# EAGLE design display_device_rev2 (EAGLE 8.3.2)
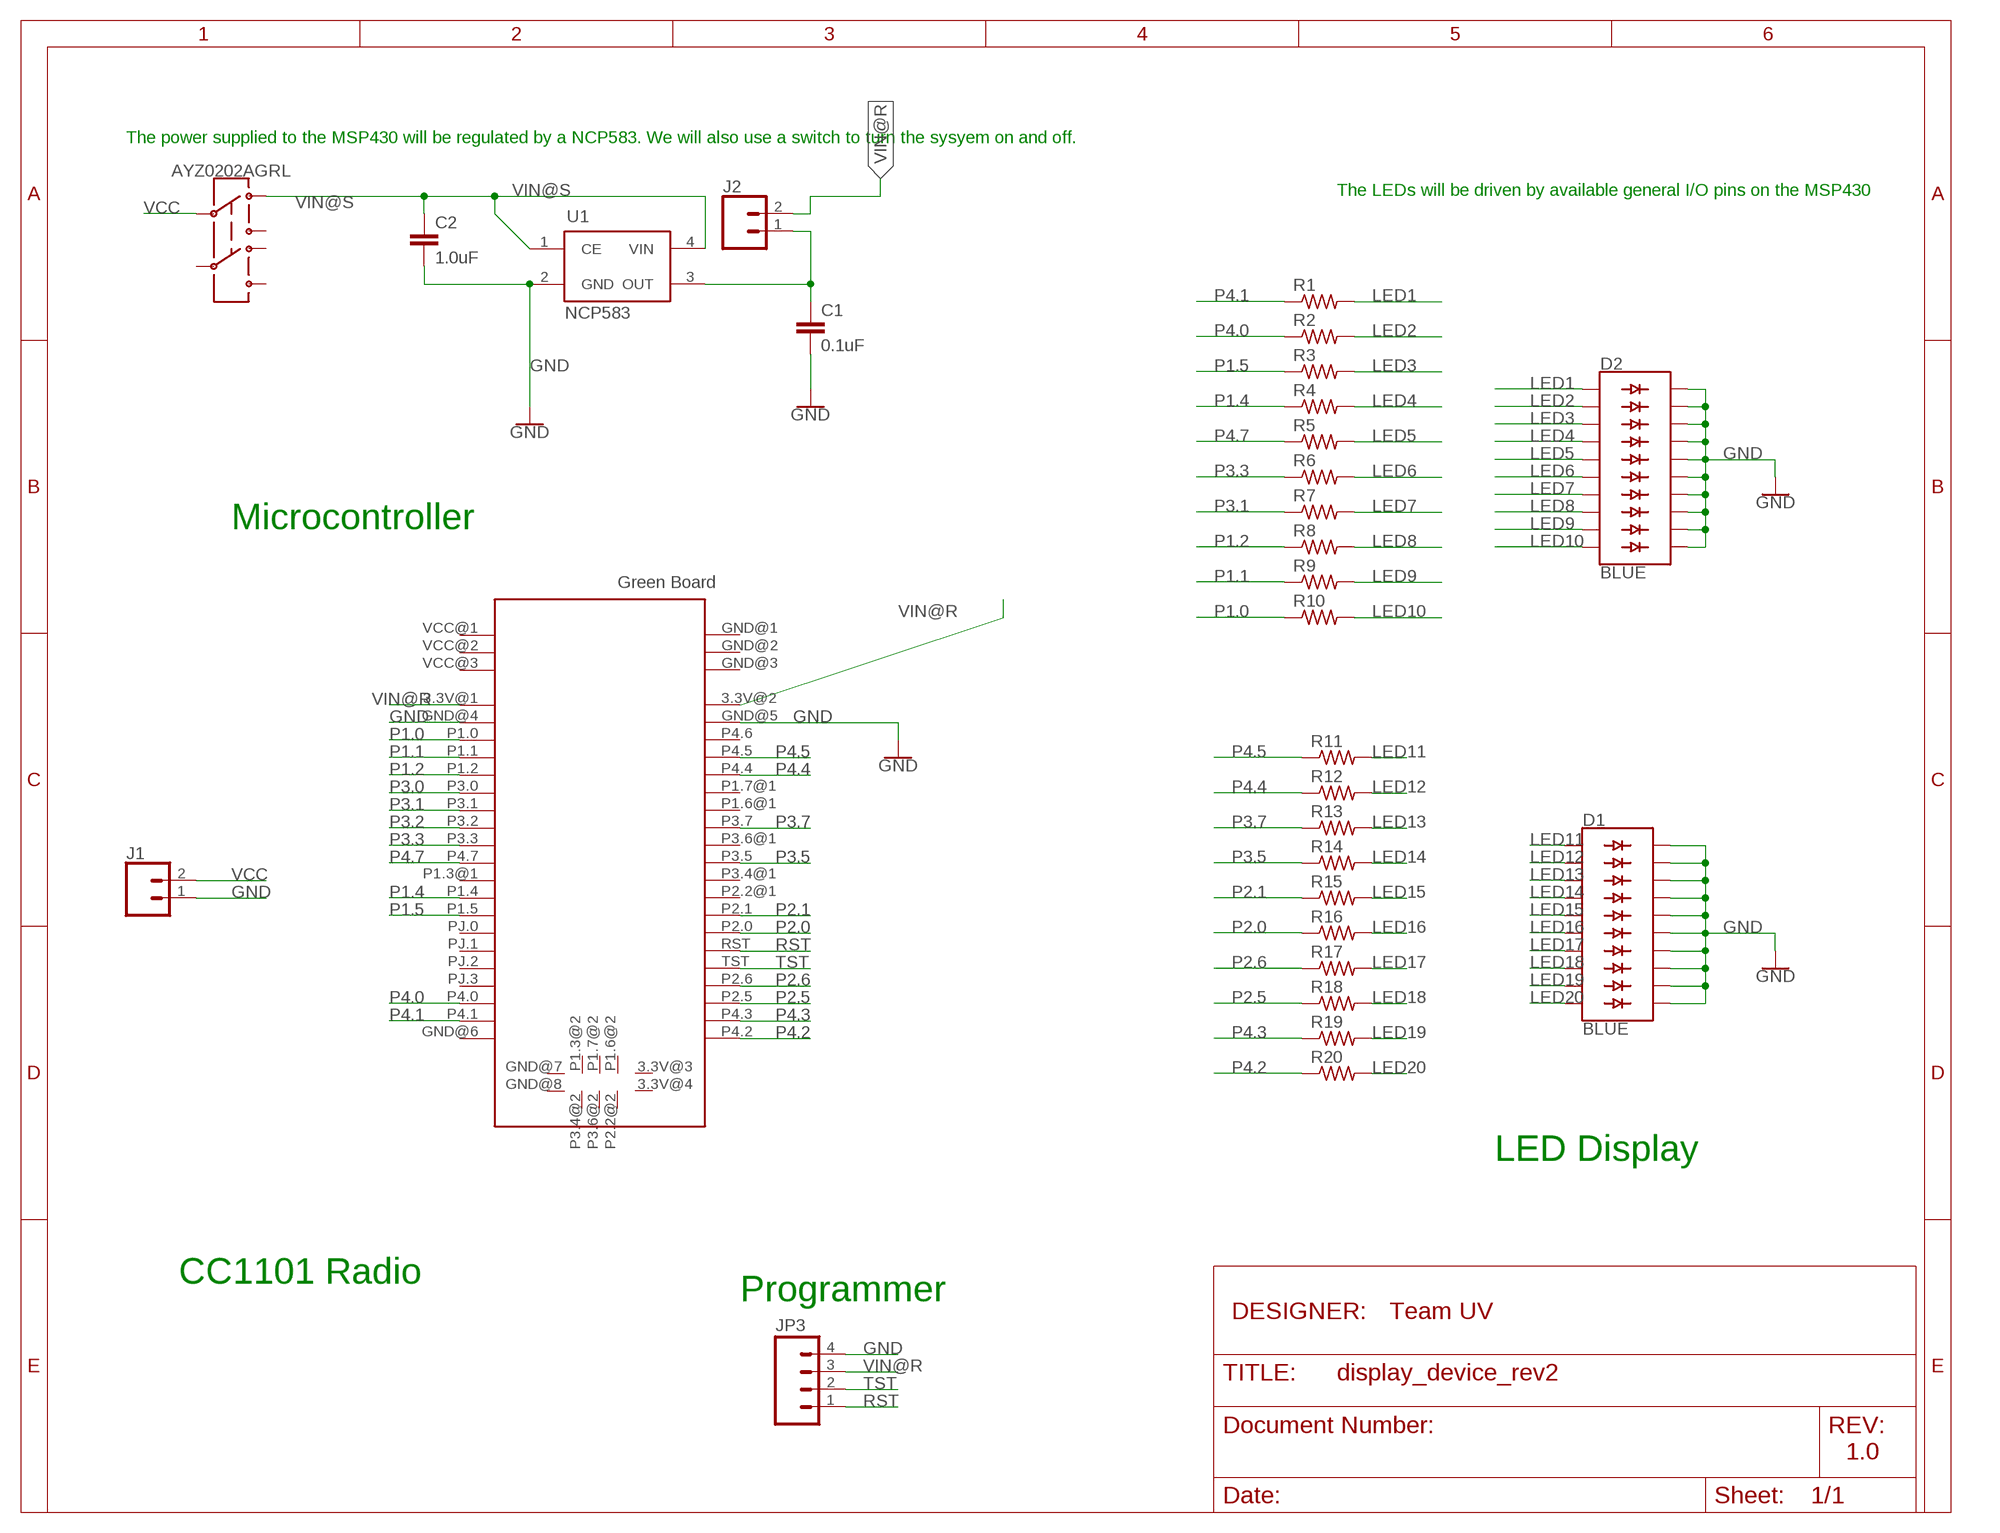
[diagram p0: schematic, sheet 1]

## Parts
AYZ0202AGRL  SWITCH-DPDT-SMD-AYZ0202  [SWITCH_DPDT_SMD_AYZ0202]
C1  0.1uF  1.0UF-0805-25V-(+80/-20%)  [0805]
C2  1.0uF  1.0UF-0805-25V-(+80/-20%)  [0805]
D1  BLUE  LED_BARGRAPH_10BLUE  [LED_BARGRAPH_10]
D2  BLUE  LED_BARGRAPH_10BLUE  [LED_BARGRAPH_10]
J1  CONN_02  [1X02]
J2  CONN_02  [1X02]
JP3  M04PTH  [1X04]
R1  R-US_R0805  [R0805]
R2  R-US_R0805  [R0805]
R3  R-US_R0805  [R0805]
R4  R-US_R0805  [R0805]
R5  R-US_R0805  [R0805]
R6  R-US_R0805  [R0805]
R7  R-US_R0805  [R0805]
R8  R-US_R0805  [R0805]
R9  R-US_R0805  [R0805]
R10  R-US_R0805  [R0805]
R11  R-US_R0805  [R0805]
R12  R-US_R0805  [R0805]
R13  R-US_R0805  [R0805]
R14  R-US_R0805  [R0805]
R15  R-US_R0805  [R0805]
R16  R-US_R0805  [R0805]
R17  R-US_R0805  [R0805]
R18  R-US_R0805  [R0805]
R19  R-US_R0805  [R0805]
R20  R-US_R0805  [R0805]
U1  NCP583  [SC82-AB_1PRIMARY]
U$1  GREEDNBRD  [GREENBRD]

## Nets
GND: C1.2 C2.2 D1.11(C9) D1.12(C8) D1.13(C7) D1.14(C6) D1.15(C5) D1.16(C4) D1.17(C3) D1.18(C2) D1.19(C1) D1.20(C) D2.11(C9) D2.12(C8) D2.13(C7) D2.14(C6) D2.15(C5) D2.16(C4) D2.17(C3) D2.18(C2) D2.19(C1) D2.20(C) J1.1 JP3.4 U1.2(GND) U$1.GND@4(GND) U$1.GND@5(GND)
LED1: D2.1(A) R1.2
LED2: D2.2(A1) R2.2
LED3: D2.3(A2) R3.2
LED4: D2.4(A3) R4.2
LED5: D2.5(A4) R5.2
LED6: D2.6(A5) R6.2
LED7: D2.7(A6) R7.2
LED8: D2.8(A7) R8.2
LED9: D2.9(A8) R9.2
LED10: D2.10(A9) R10.2
LED11: D1.1(A) R11.2
LED12: D1.2(A1) R12.2
LED13: D1.3(A2) R13.2
LED14: D1.4(A3) R14.2
LED15: D1.5(A4) R15.2
LED16: D1.6(A5) R16.2
LED17: D1.7(A6) R17.2
LED18: D1.8(A7) R18.2
LED19: D1.9(A8) R19.2
LED20: D1.10(A9) R20.2
P1.0: R10.1 U$1.P1.0
P1.1: R9.1 U$1.P1.1
P1.2: R8.1 U$1.P1.2
P1.4: R4.1 U$1.P1.4
P1.5: R3.1 U$1.P1.5
P2.0: R16.1 U$1.P2.0
P2.1: R15.1 U$1.P2.1
P2.5: R18.1 U$1.P2.5
P2.6: R17.1 U$1.P2.6
P3.0: U$1.P3.0
P3.1: R7.1 U$1.P3.1
P3.2: U$1.P3.2
P3.3: R6.1 U$1.P3.3
P3.5: R14.1 U$1.P3.5
P3.7: R13.1 U$1.P3.7
P4.0: R2.1 U$1.P4.0
P4.1: R1.1 U$1.P4.1
P4.2: R20.1 U$1.P4.2
P4.3: R19.1 U$1.P4.3
P4.4: R12.1 U$1.P4.4
P4.5: R11.1 U$1.P4.5
P4.7: R5.1 U$1.P4.7
RST: JP3.1 U$1.RST
TOPIN: C1.1 J2.1 U1.3(OUT)
TST: JP3.2 U$1.TST
VCC: AYZ0202AGRL.2 J1.2
VIN@R: J2.2 JP3.3 U$1.3.3V@1(3.3V) U$1.3.3V@2(3.3V)
VIN@S: AYZ0202AGRL.1 C2.1 U1.1(CE) U1.4(VIN)
Unconnected: AYZ0202AGRL.3 AYZ0202AGRL.4 AYZ0202AGRL.5 AYZ0202AGRL.6 U$1.3.3V@3(3.3V) U$1.3.3V@4(3.3V) U$1.GND@1(GND) U$1.GND@2(GND) U$1.GND@3(GND) U$1.GND@6(GND) U$1.GND@7(GND) U$1.GND@8(GND) U$1.P1.3@1(P1.3) U$1.P1.3@2(P1.3) U$1.P1.6@1(P1.6) U$1.P1.6@2(P1.6) U$1.P1.7@1(P1.7) U$1.P1.7@2(P1.7) U$1.P2.2@1(P2.2) U$1.P2.2@2(P2.2) U$1.P3.4@1(P3.4) U$1.P3.4@2(P3.4) U$1.P3.6@1(P3.6) U$1.P3.6@2(P3.6) U$1.P4.6 U$1.PJ.0 U$1.PJ.1 U$1.PJ.2 U$1.PJ.3 U$1.VCC@1(VCC) U$1.VCC@2(VCC) U$1.VCC@3(VCC)

## Notes on the sheet
- The power supplied to the MSP430 will be regulated by a NCP583. We will also use a switch to turn the sysyem on and off.
- The LEDs will be driven by available general I/O pins on the MSP430
- Microcontroller
- LED Display
- CC1101 Radio
- Programmer
- DESIGNER: | Team UV
- 1.0

## Library data of the parts
AYZ0202AGRL = SparkFun-Switches:SWITCH-DPDT: Double-Pole, Double-Throw (DPDT) Switch Double-pole, double-throw switches. Variant Overview PTH-GPI-152-3013 Used on SparkFun Geiger Counter <https://www.sparkfun.com/products/11345> SMD-AY0202 Surface Mount DPDT Switch <https://www.sparkfun.com/products/597> (COM-00597) Used on e.g. LilyPad Arduino USB - ATmega32U4 Board <https://www.sparkfun.com/products/12049>; PROD_ID: SWCH-08179; SF_SKU: COM-00597
C1 = SparkFun-Capacitors:1.0UF: 1µF ceramic capacitors A capacitor is a passive two-terminal electrical component used to store electrical energy temporarily in an electric field.; PROD_ID: CAP-11625; VALUE: 1.0uF
C2 = SparkFun-Capacitors:1.0UF: 1µF ceramic capacitors A capacitor is a passive two-terminal electrical component used to store electrical energy temporarily in an electric field.; PROD_ID: CAP-11625
D1 D2 = SparkFun-LED:LED_BARGRAPH_10: Young Sun LED Tech - YSLB-10251G5-10 10-Segment LED Bar Graph Features: Red Vf = 2.1V, Ifmax = 20mA Yellow Vf = 2.1V, Ifmax = 20mA Blue Vf = 3.4V, Ifmax = 20mA Green Vf = 3.4V, Ifmax = 20mA SparkFun Products: Red <https://www.sparkfun.com/products/9935> Yellow <https://www.sparkfun.com/products/9936> Green <https://www.sparkfun.com/products/9938> Blue <https://www.sparkfun.com/products/9937>; PROD_ID: DIO-10613
J1 J2 = SparkFun-Connectors:CONN_02: Multi connection point. Often used as Generic Header-pin footprint for 0.1 inch spaced/style header connections On any of the 0.1 inch spaced packages, you can populate with these: Break Away Headers - Straight <https://www.sparkfun.com/products/116> (PRT-00116) Break Away Male Headers - Right Angle <https://www.sparkfun.com/products/553> (PRT-00553) Female Headers <https://www.sparkfun.com/products/115> (PRT-00115) Break Away Headers - Machine Pin <https://www.sparkfun.com/products/117> (PRT-00117) Break Away Female Headers - Swiss Machine Pin <https://www.sparkfun.com/products/743> (PRT-00743) For SCREWTERMINALS and SPRING TERMINALS visit here: Screw Terimnals on SparkFun.com <https://www.sparkfun.com/search/results?term=Screw+Terminals> (5mm/3.5mm/2.54mm spacing) This device is also useful as a general connection point to wire up your design to another part of your project. Our various solder wires solder well into these plated through hole pads. Hook-Up Wire - Assortment (Stranded, 22 AWG) <https://www.sparkfun.com/products/11375> (PRT-11375) Hook-Up Wire - Assortment (Solid Core, 22 AWG) <https://www.sparkfun.com/products/11367> (PRT-11367) View the entire wire category on our website here <https://www.sparkfun.com/categories/141> Special notes: Molex polarized connector foot print use with: PRT-08233 with associated crimp pins and housings. 2.54_SCREWTERM for use with PRT-10571. 3.5mm Screw Terminal footprints for PRT-08084 5mm Screw Terminal footprints for use with PRT-08432
JP3 = Moo1.2:M04: Header 4 Standard 4-pin 0.1" header. Use with straight break away headers (SKU : PRT-00116), right angle break away headers (PRT-00553), swiss pins (PRT-00743), machine pins (PRT-00117), and female headers (PRT-00115). Molex polarized connector foot print use with SKU : PRT-08231 with associated crimp pins and housings. 1MM SMD Version SKU: PRT-10208
R1-R20 = rcl:R-US_: RESISTOR, American symbol
U1 = ncp583:NCP583: NCP583 - Ultra-Low Iq 150 mA CMOS LDO Regulator with Enable The NCP583 series of low dropout regulators are designed for portable battery powered applications which require precise output voltage accuracy and low quiescent current. These devices feature an enable function which lowers current consumption significantly and are offered in two small packages; SC−82AB and the SOT−563. A 1.0 mF ceramic capacitor is the recommended value to be used with these devices on the output pin.
U$1 = GreenBoard:GREEDNBRD

## Board
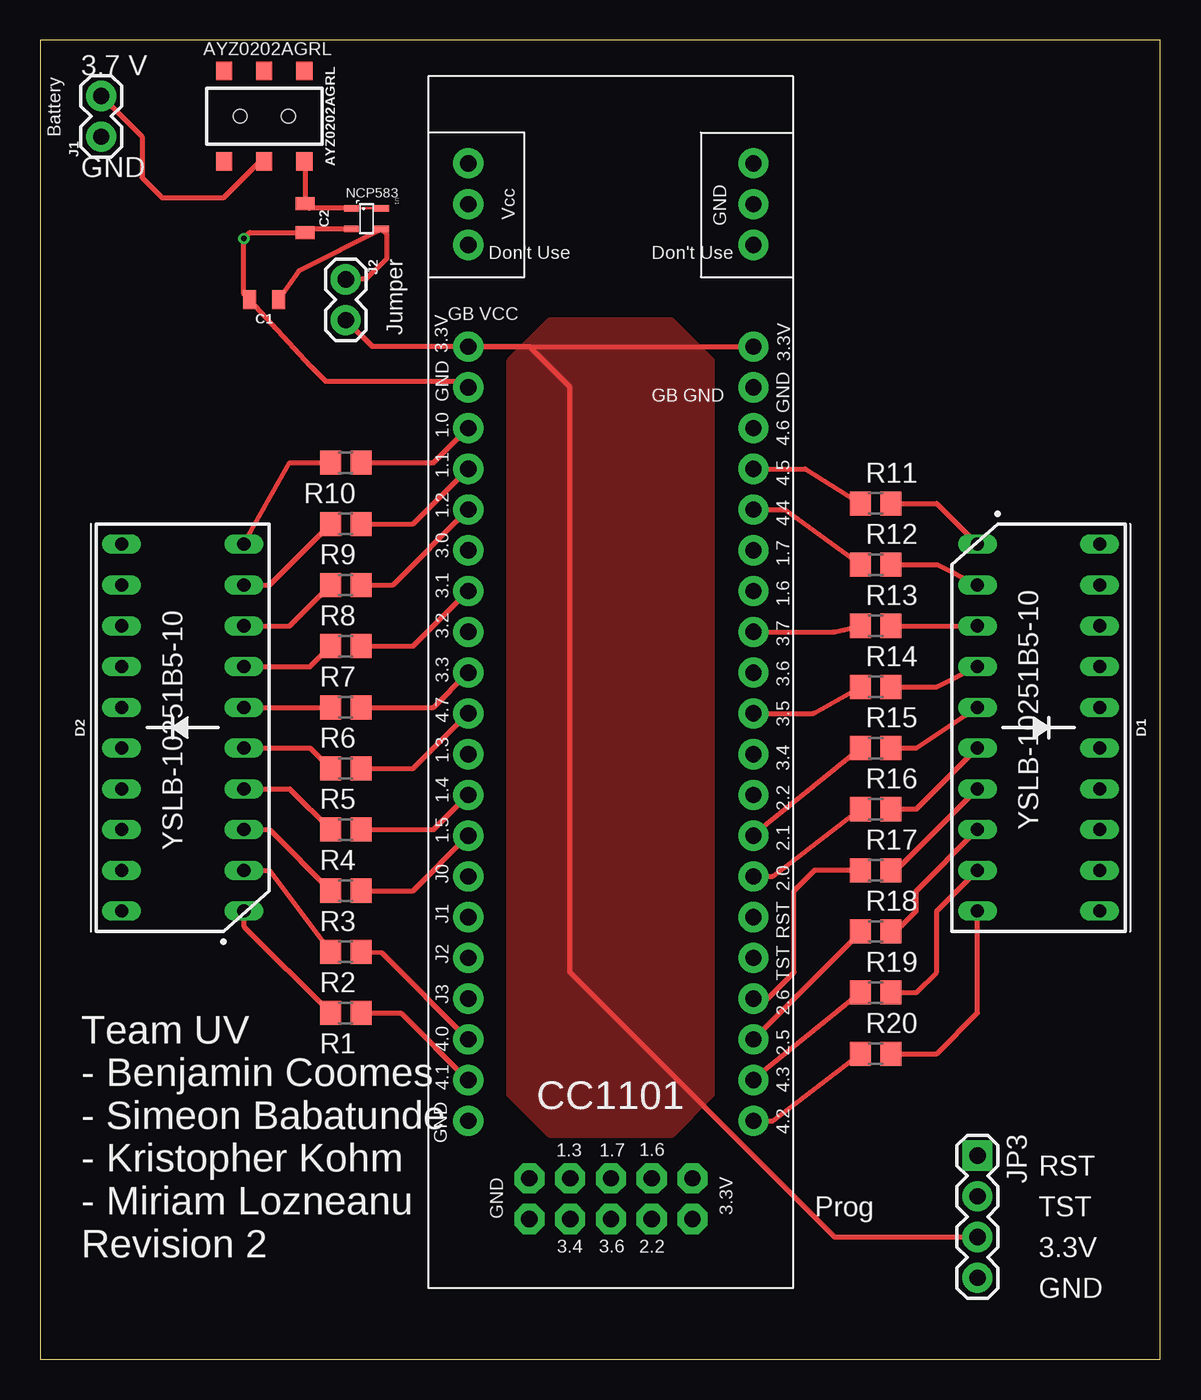
[diagram p1: board, top side]
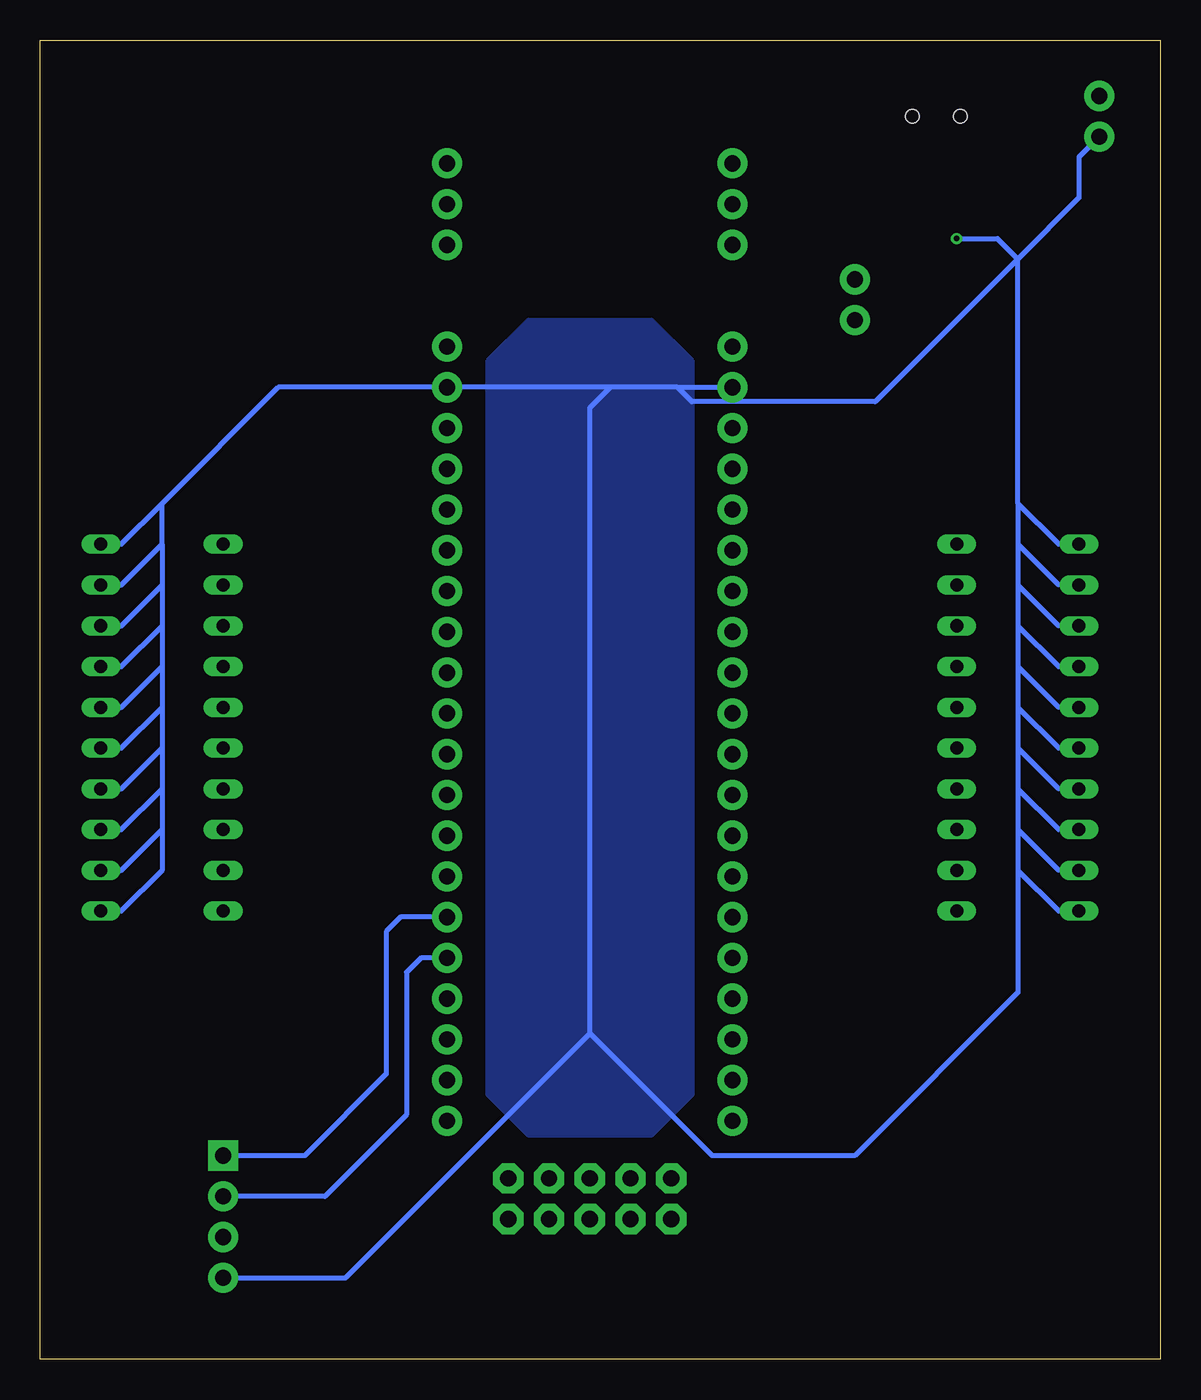
[diagram p2: board, bottom side, seen from below]

Size 69.83 x 82.22 mm. Coordinates in mm from the lower left corner, seen from the top.
Outline: 0,0 69.83,0 69.83,82.22 0,82.22 0,0
Copper layers (1*16): Top 0.0356mm / dielectric 1.5011mm / Bottom 0.0356mm
Design rules "oshpark-2layer": minimum track width 6mil, minimum drill 13mil, track to track 6mil, track to pad 6mil, pad to pad 6mil, via to via 6mil, smd to smd 6mil, copper to edge 15mil, drill to drill 6mil, minimum pad ring 7mil, minimum via ring 7mil, stop-mask expansion 2.5mil, vias tented up to drill 0mil, thermal gap 10mil

### Footprints (pad centres in the part's own frame; a part is rotated, then mirrored left to right if it is on the bottom)
SWITCH_DPDT_SMD_AYZ0202 = smd 1 x 1.15: 1 -2.5,2.825; 2 0,2.825; 3 2.5,2.825; 4 -2.5,-2.825; 5 0,-2.825; 6 2.5,-2.825 | hole 0.85: 1.5,0; -1.5,0
0805 = smd 0.8 x 1.2: 1 -0.9,0; 2 0.9,0
LED_BARGRAPH_10 = drill 0.813 long: 1 -11.43,-3.81; 2 -8.89,-3.81; 3 -6.35,-3.81; 4 -3.81,-3.81; 5 -1.27,-3.81; 6 1.27,-3.81; 7 3.81,-3.81; 8 6.35,-3.81; 9 8.89,-3.81; 10 11.43,-3.81; 11 11.43,3.81; 12 8.89,3.81; 13 6.35,3.81; 14 3.81,3.81; 15 1.27,3.81; 16 -1.27,3.81; 17 -3.81,3.81; 18 -6.35,3.81; 19 -8.89,3.81; 20 -11.43,3.81
1X02 = drill 1.016 pad 1.88: 1 0,0; 2 2.54,0
1X04 = drill 1.016 pad 1.88 square: 1 0,0 | drill 1.016 pad 1.88: 2 2.54,0; 3 5.08,0; 4 7.62,0
R0805 = smd 1.3 x 1.5: 1 -0.95,0; 2 0.95,0
SC82-AB_1PRIMARY = smd 0.406 x 0.914: 1 -0.621,-0.913; 2 0.675,-0.913; 3 0.675,0.967; 4 -0.621,0.967
GREENBRD = drill 1.015 pad 1.88: 3.3V@1 -8.875,21.21; 3.3V@2 8.905,21.21; GND@1 8.905,32.63; GND@2 8.905,30.09; GND@3 8.905,27.55; GND@4 -8.875,18.67; GND@5 8.905,18.67; GND@6 -8.875,-27.05; P1.0 -8.875,16.13; P1.1 -8.875,13.59; P1.2 -8.875,11.05; P1.3@1 -8.875,-4.19; P1.4 -8.875,-6.73; P1.5 -8.875,-9.27; P1.6@1 8.905,5.97; P1.7@1 8.905,8.51; P2.0 8.905,-11.81; P2.1 8.905,-9.27; P2.2@1 8.905,-6.73; P2.5 8.905,-21.97; P2.6 8.905,-19.43; P3.0 -8.875,8.51; P3.1 -8.875,5.97; P3.2 -8.875,3.43; P3.3 -8.875,0.89; P3.4@1 8.905,-4.19; P3.5 8.905,-1.65; P3.6@1 8.905,0.89; P3.7 8.905,3.43; P4.0 -8.875,-21.97; P4.1 -8.875,-24.51; P4.2 8.905,-27.05; P4.3 8.905,-24.51; P4.4 8.905,11.05; P4.5 8.905,13.59; P4.6 8.905,16.13; P4.7 -8.875,-1.65; PJ.0 -8.875,-11.81; PJ.1 -8.875,-14.35; PJ.2 -8.875,-16.89; PJ.3 -8.875,-19.43; RST 8.905,-14.35; TST 8.905,-16.89; VCC@1 -8.875,32.63; VCC@2 -8.875,30.09; VCC@3 -8.875,27.55 | drill 1.015 pad 1.88 octagon: 3.3V@3 5.095,-30.63; 3.3V@4 5.095,-33.17; GND@7 -5.065,-30.63; GND@8 -5.065,-33.17; P1.3@2 -2.525,-30.63; P1.6@2 2.555,-30.63; P1.7@2 0.015,-30.63; P2.2@2 2.555,-33.17; P3.4@2 -2.525,-33.17; P3.6@2 0.015,-33.17

### Placement (x,y rotation side)
AYZ0202AGRL  13.97,77.47 180 top
C1  13.97,66.04 180 top
C2  16.51,71.12 270 top
D1  62.23,39.37 270 top
D2  8.89,39.37 90 top
J1  3.81,76.2 90 top
J2  19.05,67.31 270 top
JP3  58.42,12.7 270 top
R1  19.05,21.59 180 top
R2  19.05,25.4 180 top
R3  19.05,29.21 180 top
R4  19.05,33.02 180 top
R5  19.05,36.83 180 top
R6  19.05,40.64 180 top
R7  19.05,44.45 180 top
R8  19.05,48.26 180 top
R9  19.05,52.07 180 top
R10  19.05,55.88 180 top
R11  52.07,53.34 0 top
R12  52.07,49.53 0 top
R13  52.07,45.72 0 top
R14  52.07,41.91 0 top
R15  52.07,38.1 0 top
R16  52.07,34.29 0 top
R17  52.07,30.48 0 top
R18  52.07,26.67 0 top
R19  52.07,22.86 0 top
R20  52.07,19.05 0 top
U1  20.32,71.12 270 top
U$1  35.56,41.91 0 top

### Tracks (layer width: path | path; a pad name or v marks a point on that pad's centre or on a via)
GND  (via drill 0.35)
  Top 0.305: U1.2 16.73,70.44 C2.2 13.07,70.22 v12.7,69.85 12.7,66.41 C1.2 16.88,61.86 17.78,60.96 26.3,60.96 U$1.GND@4
  Bottom 0.305: JP3.4 50.8,5.08 35.56,20.32 | 62.23,53.34 54.99,60.58 U$1.GND@5 34.29,60.58 | 62.23,35.56 62.23,33.02 | 62.23,38.1 62.23,35.56 | 62.23,40.64 62.23,38.1 | 62.23,43.18 62.23,40.64 | 62.23,45.72 62.23,43.18 | 62.23,48.26 62.23,45.72 | 62.23,50.8 62.23,48.26 | 62.23,50.8 62.23,53.34 | 62.23,33.02 62.23,30.48 64.77,27.94 D1.11 | D1.12 64.77,30.48 62.23,33.02 | D1.13 64.77,33.02 62.23,35.56 | D1.14 64.77,35.56 62.23,38.1 | D1.15 64.77,38.1 62.23,40.64 | D1.16 64.77,40.64 62.23,43.18 | D1.17 64.77,43.18 62.23,45.72 | D1.18 64.77,45.72 62.23,48.26 | D1.19 64.77,48.26 62.23,50.8 | D1.20 64.77,50.8 62.23,53.34 | 35.56,20.32 35.56,59.31 34.29,60.58 | D2.20 6.35,27.94 8.89,30.48 | 8.89,35.56 8.89,33.02 | 8.89,38.1 8.89,35.56 | 8.89,40.64 8.89,38.1 | 8.89,43.18 8.89,40.64 | 8.89,45.72 8.89,43.18 | 8.89,48.26 8.89,45.72 | 8.89,50.8 8.89,48.26 | 8.89,53.34 8.89,50.8 | 8.89,53.34 8.89,68.58 | 8.89,33.02 8.89,30.48 | v12.7,69.85 10.16,69.85 8.89,68.58 | D2.19 6.35,30.48 8.89,33.02 | D2.18 6.35,33.02 8.89,35.56 | D2.17 6.35,35.56 8.89,38.1 | D2.16 6.35,38.1 8.89,40.64 | D2.15 6.35,40.64 8.89,43.18 | D2.14 6.35,43.18 8.89,45.72 | D2.13 6.35,45.72 8.89,48.26 | D2.12 6.35,48.26 8.89,50.8 | D2.11 6.35,50.8 8.89,53.34 | 30.1,60.58 U$1.GND@4 | 30.1,60.58 34.29,60.58 | 8.89,30.48 8.89,22.86 19.05,12.7 27.94,12.7 35.56,20.32 | J1.1 5.08,74.93 5.08,72.39 8.89,68.58 | 8.89,68.58 17.78,59.69 29.21,59.69 30.1,60.58
  pour Bottom: 29.21,62.23 29.21,16.51 31.75,13.97 39.37,13.97 41.91,16.51 41.91,62.23 39.37,64.77 31.75,64.77
LED1
  Top 0.305: D2.1 12.7,26.99 R1.2
LED2
  Top 0.305: D2.2 14.29,30.48 R2.2
LED3
  Top 0.305: D2.3 14.29,33.02 R3.2
LED4
  Top 0.305: D2.4 15.56,35.56 R4.2
LED5
  Top 0.305: D2.5 16.83,38.1 R5.2
LED6
  Top 0.305: D2.6 R6.2
LED7
  Top 0.305: D2.7 16.83,43.18 R7.2
LED8
  Top 0.305: D2.8 15.56,45.72 R8.2
LED9
  Top 0.305: D2.9 14.29,48.26 R9.2
LED10
  Top 0.305: D2.10 15.56,55.88 R10.2
LED11
  Top 0.305: R11.2 55.88,53.34 D1.1
LED12
  Top 0.305: R12.2 55.88,49.53 D1.2
LED13
  Top 0.305: R13.2 D1.3
LED14
  Top 0.305: R14.2 55.88,41.91 D1.4
LED15
  Top 0.305: R15.2 54.61,38.1 D1.5
LED16
  Top 0.305: R16.2 54.61,34.29 D1.6
LED17
  Top 0.305: R17.2 53.34,30.48 D1.7
LED18
  Top 0.305: R18.2 53.34,26.67 54.61,27.94 54.61,29.21 D1.8
LED19
  Top 0.305: R19.2 54.61,22.86 55.88,24.13 55.88,27.94 D1.9
LED20
  Top 0.305: R20.2 55.88,19.05 58.42,21.59 D1.10
P1.0
  Top 0.305: R10.1 24.52,55.88 U$1.P1.0
P1.1
  Top 0.305: R9.1 23.26,52.07 U$1.P1.1
P1.2
  Top 0.305: R8.1 21.98,48.26 U$1.P1.2
P1.4
  Top 0.305: R4.1 24.52,33.02 U$1.P1.4
P1.5
  Top 0.305: R3.1 23.26,29.21 U$1.P1.5
P2.0
  Top 0.305: U$1.P2.0 45.66,30.1 R16.1
P2.1
  Top 0.305: U$1.P2.1 44.47,32.72 R15.1
P2.5
  Top 0.305: R18.1 51.12,26.59 U$1.P2.5
P2.6
  Top 0.305: R17.1 48.26,30.48 46.99,29.21 46.99,24.13 45.34,22.48 U$1.P2.6
P3.1
  Top 0.305: R7.1 23.26,44.45 U$1.P3.1
P3.3
  Top 0.305: R6.1 24.52,40.64 U$1.P3.3
P3.5
  Top 0.305: U$1.P3.5 48.2,40.26 R14.1
P3.7
  Top 0.305: U$1.P3.7 49.47,45.34 R13.1
P4.0
  Top 0.305: R2.1 21.27,25.36 U$1.P4.0
P4.1
  Top 0.305: R1.1 22.49,21.59 U$1.P4.1
P4.2
  Top 0.305: U$1.P4.2 45.66,14.86 R20.1
P4.3
  Top 0.305: U$1.P4.3 44.47,17.48 R19.1
P4.4
  Top 0.305: U$1.P4.4 46.42,52.96 R12.1
P4.5
  Top 0.305: U$1.P4.5 47.69,55.5 R11.1
P4.7
  Top 0.305: R5.1 23.26,36.83 U$1.P4.7
RST
  Bottom 0.305: U$1.RST 47.37,27.56 48.26,26.67 48.26,17.78 53.34,12.7 JP3.1
TOPIN
  Top 0.305: C1.1 16.14,67.84 U1.3 21.59,70.14 21.59,68.58 20.32,67.31 J2.1
TST
  Bottom 0.305: U$1.TST 46.1,25.02 46.99,24.13 46.99,15.24 52.07,10.16 JP3.2
VCC
  Top 0.305: J1.2 6.35,76.2 6.35,73.66 7.62,72.39 11.43,72.39 13.68,74.64 AYZ0202AGRL.2
VIN@R
  Top 0.305: JP3.3 49.53,7.62 33.02,24.13 33.02,60.6 30.48,63.14 26.71,63.14 | U$1.3.3V@2 U$1.3.3V@1 26.71,63.14 | J2.2 20.68,63.14 26.71,63.14
  pour Top: 31.75,64.77 29.21,62.23 29.21,16.51 31.75,13.97 39.37,13.97 41.91,16.51 41.91,62.23 39.37,64.77
VIN@S
  Top 0.152: U1.4 U1.1
  Top 0.305: U1.1 16.79,71.74 C2.1 16.51,74.61 AYZ0202AGRL.1

### Text on the board
tPlace: 3.7 V | Jumper
tNames: AYZ0202AGRL | Battery | GND | NCP583 | Don't Use | Don't Use | GB VCC | GB GND | YSLB-10251B5-10 | YSLB-10251B5-10 | RST | Prog | TST | Team UV / - Benjamin Coomes / - Simeon Babatunde / - Kristopher Kohm / - Miriam Lozneanu / Revision 2 | 3.3V | GND